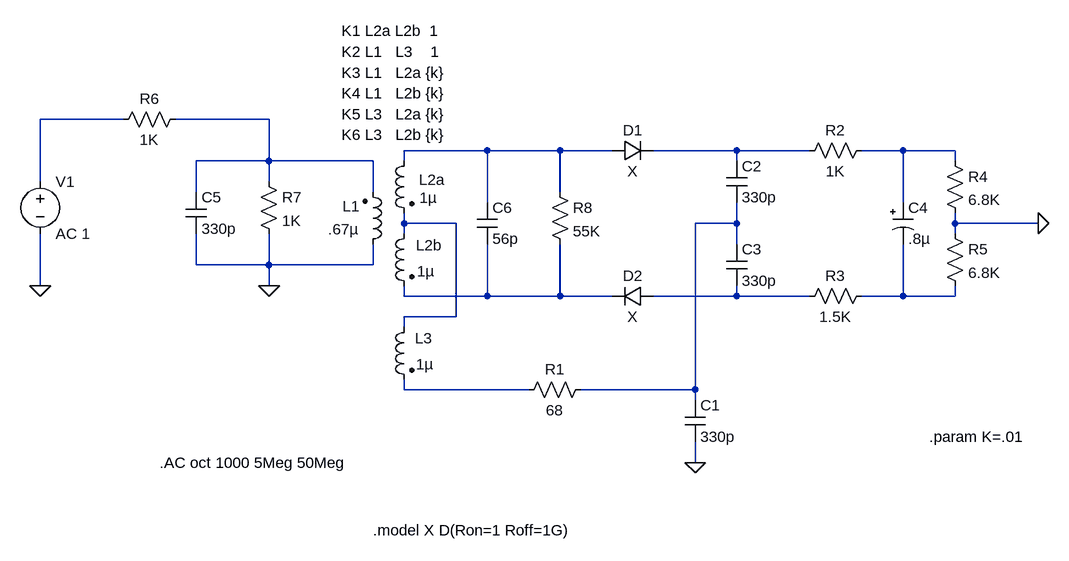
[diagram p0: schematic ratio.asc]
ratio.asc, the LTspice schematic file:
Version 4
SHEET 1 3076 1688
WIRE 1648 1040 1520 1040
WIRE 1872 1040 1728 1040
WIRE 2208 1088 2080 1088
WIRE 2320 1088 2208 1088
WIRE 2400 1088 2320 1088
WIRE 2592 1088 2464 1088
WIRE 2704 1088 2592 1088
WIRE 2848 1088 2784 1088
WIRE 2928 1088 2848 1088
WIRE 1872 1104 1872 1040
WIRE 1872 1104 1760 1104
WIRE 2032 1104 1872 1104
WIRE 2080 1104 2080 1088
WIRE 2592 1104 2592 1088
WIRE 2928 1104 2928 1088
WIRE 1520 1136 1520 1040
WIRE 1872 1136 1872 1104
WIRE 1760 1152 1760 1104
WIRE 2032 1152 2032 1104
WIRE 2320 1152 2320 1088
WIRE 2208 1168 2208 1088
WIRE 2848 1168 2848 1088
WIRE 2080 1200 2080 1184
WIRE 2160 1200 2080 1200
WIRE 2592 1200 2592 1168
WIRE 2592 1200 2528 1200
WIRE 2928 1200 2928 1184
WIRE 3056 1200 2928 1200
WIRE 2080 1216 2080 1200
WIRE 2928 1216 2928 1200
WIRE 2592 1232 2592 1200
WIRE 1760 1264 1760 1216
WIRE 1872 1264 1872 1216
WIRE 1872 1264 1760 1264
WIRE 2032 1264 2032 1232
WIRE 2032 1264 1872 1264
WIRE 1520 1296 1520 1216
WIRE 1872 1296 1872 1264
WIRE 2080 1312 2080 1296
WIRE 2208 1312 2208 1232
WIRE 2208 1312 2080 1312
WIRE 2320 1312 2320 1232
WIRE 2320 1312 2208 1312
WIRE 2400 1312 2320 1312
WIRE 2592 1312 2592 1296
WIRE 2592 1312 2464 1312
WIRE 2704 1312 2592 1312
WIRE 2848 1312 2848 1232
WIRE 2848 1312 2784 1312
WIRE 2928 1312 2928 1296
WIRE 2928 1312 2848 1312
WIRE 2160 1344 2160 1200
WIRE 2160 1344 2080 1344
WIRE 2080 1360 2080 1344
WIRE 2080 1456 2080 1440
WIRE 2272 1456 2080 1456
WIRE 2528 1456 2528 1200
WIRE 2528 1456 2352 1456
WIRE 2528 1472 2528 1456
WIRE 2528 1568 2528 1536
FLAG 2528 1568 0
FLAG 3056 1200 0
FLAG 1872 1296 0
FLAG 1520 1296 0
SYMBOL ind2 2016 1248 M180
WINDOW 0 -4 74 Right 2
WINDOW 3 -6 39 Right 2
SYMATTR InstName L1
SYMATTR Value .67µ
SYMBOL ind2 2096 1088 M0
WINDOW 0 -7 45 Right 2
WINDOW 3 -8 73 Right 2
SYMATTR InstName L2a
SYMATTR Value 1µ
SYMBOL ind2 2096 1200 M0
WINDOW 0 -2 34 Right 2
WINDOW 3 -4 74 Right 2
SYMATTR InstName L2b
SYMATTR Value 1µ
SYMBOL ind2 2096 1344 M0
WINDOW 0 -1 33 Right 2
WINDOW 3 -2 73 Right 2
SYMATTR InstName L3
SYMATTR Value 1µ
SYMBOL res 2368 1440 R90
WINDOW 0 0 56 VBottom 2
WINDOW 3 32 56 VTop 2
SYMATTR InstName R1
SYMATTR Value 68
SYMBOL cap 2512 1472 R0
SYMATTR InstName C1
SYMATTR Value 330p
SYMBOL diode 2400 1104 R270
WINDOW 0 32 32 VTop 2
WINDOW 3 0 32 VBottom 2
SYMATTR InstName D1
SYMATTR Value X
SYMBOL diode 2464 1328 M270
WINDOW 0 32 32 VTop 2
WINDOW 3 0 32 VBottom 2
SYMATTR InstName D2
SYMATTR Value X
SYMBOL cap 2576 1104 R0
SYMATTR InstName C2
SYMATTR Value 330p
SYMBOL cap 2576 1232 R0
SYMATTR InstName C3
SYMATTR Value 330p
SYMBOL res 2800 1072 R90
WINDOW 0 0 56 VBottom 2
WINDOW 3 32 56 VTop 2
SYMATTR InstName R2
SYMATTR Value 1K
SYMBOL res 2800 1296 R90
WINDOW 0 0 56 VBottom 2
WINDOW 3 32 56 VTop 2
SYMATTR InstName R3
SYMATTR Value 1.5K
SYMBOL polcap 2832 1168 R0
SYMATTR InstName C4
SYMATTR Value .8µ
SYMBOL res 2912 1088 R0
SYMATTR InstName R4
SYMATTR Value 6.8K
SYMBOL res 2912 1200 R0
SYMATTR InstName R5
SYMATTR Value 6.8K
SYMBOL cap 1744 1152 R0
SYMATTR InstName C5
SYMATTR Value 330p
SYMBOL voltage 1520 1120 R0
SYMATTR InstName V1
SYMATTR Value AC 1
SYMBOL res 1744 1024 R90
WINDOW 0 0 56 VBottom 2
WINDOW 3 32 56 VTop 2
SYMATTR InstName R6
SYMATTR Value 1K
SYMBOL res 1856 1120 R0
SYMATTR InstName R7
SYMATTR Value 1K
SYMBOL cap 2192 1168 R0
SYMATTR InstName C6
SYMATTR Value 56p
SYMBOL res 2304 1136 R0
SYMATTR InstName R8
SYMATTR Value 55K
TEXT 2032 1672 Left 2 !.model X D(Ron=1 Roff=1G)
TEXT 1704 1568 Left 2 !.AC oct 1000 5Meg 50Meg
TEXT 1984 904 Left 2 !K1 L2a L2b  1
TEXT 1984 936 Left 2 !K2 L1   L3    1
TEXT 1984 968 Left 2 !K3 L1   L2a {k}
TEXT 1984 1000 Left 2 !K4 L1   L2b {k}
TEXT 1984 1032 Left 2 !K5 L3   L2a {k}
TEXT 1984 1064 Left 2 !K6 L3   L2b {k}
TEXT 2888 1528 Left 2 !.param K=.01

The netlist it stands for:
* ratio.asc
L1 0 N002 .67µ
L2a N003 N006 1µ
L2b N006 N008 1µ
L3 N006 N011 1µ
R1 N007 N011 68
C1 N007 0 330p
D1 N003 N004 X
D2 N009 N008 X
C2 N004 N007 330p
C3 N007 N009 330p
R2 N005 N004 1K
R3 N010 N009 1.5K
C4 N005 N010 .8µ
R4 N005 0 6.8K
R5 0 N010 6.8K
C5 N002 0 330p
V1 N001 0 AC 1
R6 N002 N001 1K
R7 N002 0 1K
C6 N003 N008 56p
R8 N003 N008 55K
.model D D
.lib standard.dio
.model X D(Ron=1 Roff=1G)
.AC oct 1000 5Meg 50Meg
K1 L2a L2b  1
K2 L1   L3    1
K3 L1   L2a {k}
K4 L1   L2b {k}
K5 L3   L2a {k}
K6 L3   L2b {k}
.param K=.01
.backanno
.end